# EAGLE design Curios (EAGLE 9.6.2)
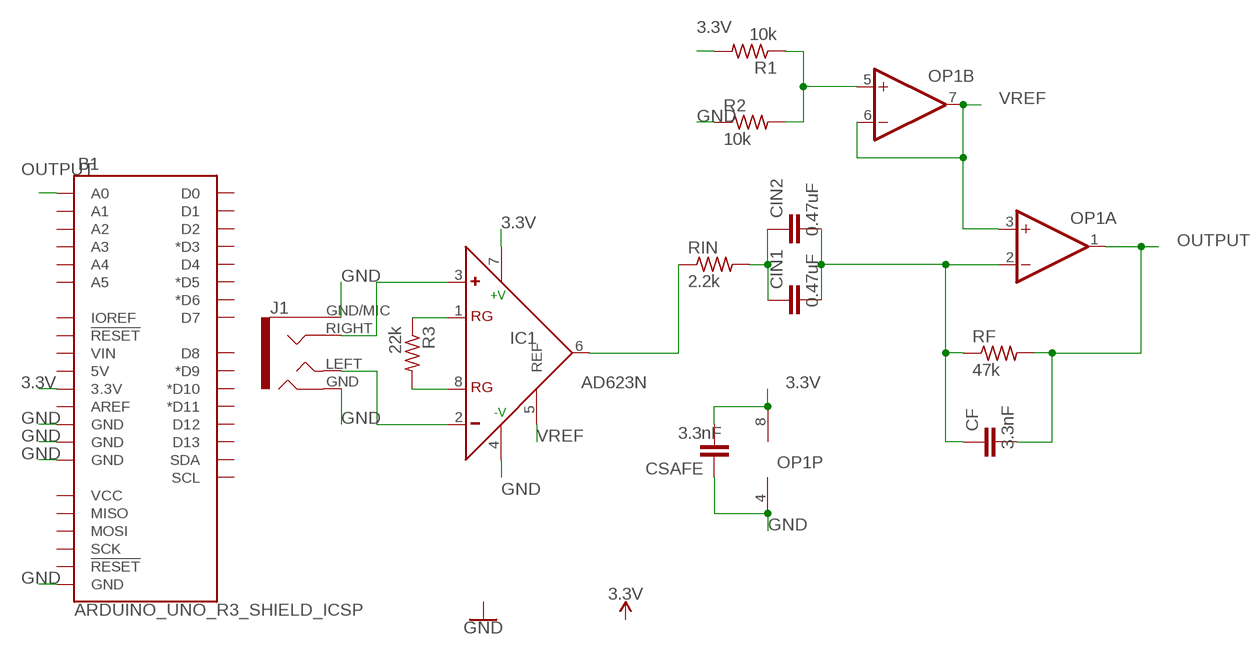
[diagram p0: schematic, sheet 1]

## Parts
B1  ARDUINO_UNO_R3_SHIELD_ICSP  [UNO_R3_SHIELD_ICSP]
CF  3.3nF  CAPACITOR0603  [C0603]
CIN1  0.47uF  CAPACITOR0603  [C0603]
CIN2  0.47uF  CAPACITOR0603  [C0603]
CSAFE  3.3nF  CAPACITOR0603  [C0603]
IC1  AD623N  [DIL08]
J1  AUDIO_JACK_TRRSSMD_RA  [AUDIO_JACK_3.5MM_TRRS_SMD_RA]
OP1  OP-DUALR  [SO8]
R1  10k  RESISTOR0603  [R0603]
R2  10k  RESISTOR0603  [R0603]
R3  22k  RESISTOR0603  [R0603]
RF  47k  RESISTOR0603  [R0603]
RIN  2.2k  RESISTOR0603  [R0603]

## Nets
3.3V: B1.3.3V CSAFE.2 IC1.7(+V) OP1.8(P:V+) R1.2
GND: B1.GND@0(GND) B1.GND@1(GND) B1.GND@2(GND) B1.GND_ICSP(GND) CSAFE.1 IC1.4(-V) J1.GND(RING2) J1.GND/MIC(SLEEVE) OP1.4(P:V-) R2.1
N$1: CIN1.1 CIN2.1 RIN.2
N$2: IC1.3(+) J1.RIGHT(RING1)
N$3: OP1.5(B:+IN) R1.1 R2.2
N$4: IC1.6(OUT) RIN.1
N$5: IC1.1(RG) R3.1
N$6: CF.1 CIN1.2 CIN2.2 OP1.2(A:-IN) RF.1
N$7: IC1.8(RG) R3.2
N$8: IC1.2(-) J1.LEFT(TIP)
OUTPUT: B1.A0 CF.2 OP1.1(A:OUT) RF.2
VREF: IC1.5(REF) OP1.3(A:+IN) OP1.6(B:-IN) OP1.7(B:OUT)
Unconnected: B1.5V B1.5V_ICSP(VCC) B1.A1 B1.A2 B1.A3 B1.A4 B1.A5 B1.AREF B1.D2 B1.D3(*D3) B1.D4 B1.D5(*D5) B1.D6(*D6) B1.D7 B1.D8 B1.D9(*D9) B1.D10(*D10) B1.D11(*D11) B1.D12 B1.D13 B1.IOREF B1.MISO B1.MOSI B1.RES(!RESET!) B1.RST_ICSP(!RESET!) B1.RX(D0) B1.SCK B1.SCL B1.SDA B1.TX(D1) B1.VIN

## Library data of the parts
B1 = LinnesLab-Microcontrollers:ARDUINO_UNO_R3_SHIELD_ICSP: Arduino R3 Shield Footprint with ICSP Header Includes pins for 6-pin (2x3) ICSP Header. Compatible with Leonardo boards that require SPI pin connections via this header. SparkFun Products: CryptoShield <https://www.sparkfun.com/products/13183> microSD Shield <https://www.sparkfun.com/products/12761> R3 Stackable Headers Kit <https://www.sparkfun.com/products/1417>
CF CIN1 CIN2 CSAFE = LinnesLab-Passives:CAPACITOR
IC1 = LinnesLab-AnalogIC:AD623: Single-Supply, Rail-to-Rail, Low Cost Instrumentation Amplifier Source: http://www.analog.com/static/imported-files/data_sheets/AD623.pdf; MF: ALTERA CORPORATION; MPN: AD623ANZ; OC_FARNELL: 9603700; OC_NEWARK: 59K4402
J1 = LinnesLab-Connectors:AUDIO_JACK_TRRS: Audio Jack - 3.5mm TRRS (SMD) This is a 3.5mm TRRS SMD audio jack. TRRS connectors are the audio-style connectors that you see on some phones, MP3 players and development boards. TRRS stands for “tip, ring, ring, sleeve,” which reflects that this has three conductors and a ground. SparkFun Products: Audio Jack <https://www.sparkfun.com/products/12639> mbed Starter Kit <https://www.sparkfun.com/products/12968> SparkFun TRRS 3.5mm Jack Breakout <https://www.sparkfun.com/products/11570>; PROD_ID: CONN-10676; SF_ID: PRT-12639
OP1 = LinnesLab-AnalogIC:OP-DUAL: Precision Micropower, Low Noise CMOS, Rail-to-Rail Input/Output Operational Amplifiers Source: http://www.analog.com/static/imported-files/data_sheets/AD8603_8607_8609.pdf; MPN: AD8607ARMZ-R2; OC_FARNELL: 1651293; OC_NEWARK: 19M8927
R1-R3 RF RIN = LinnesLab-Passives:RESISTOR

## Board
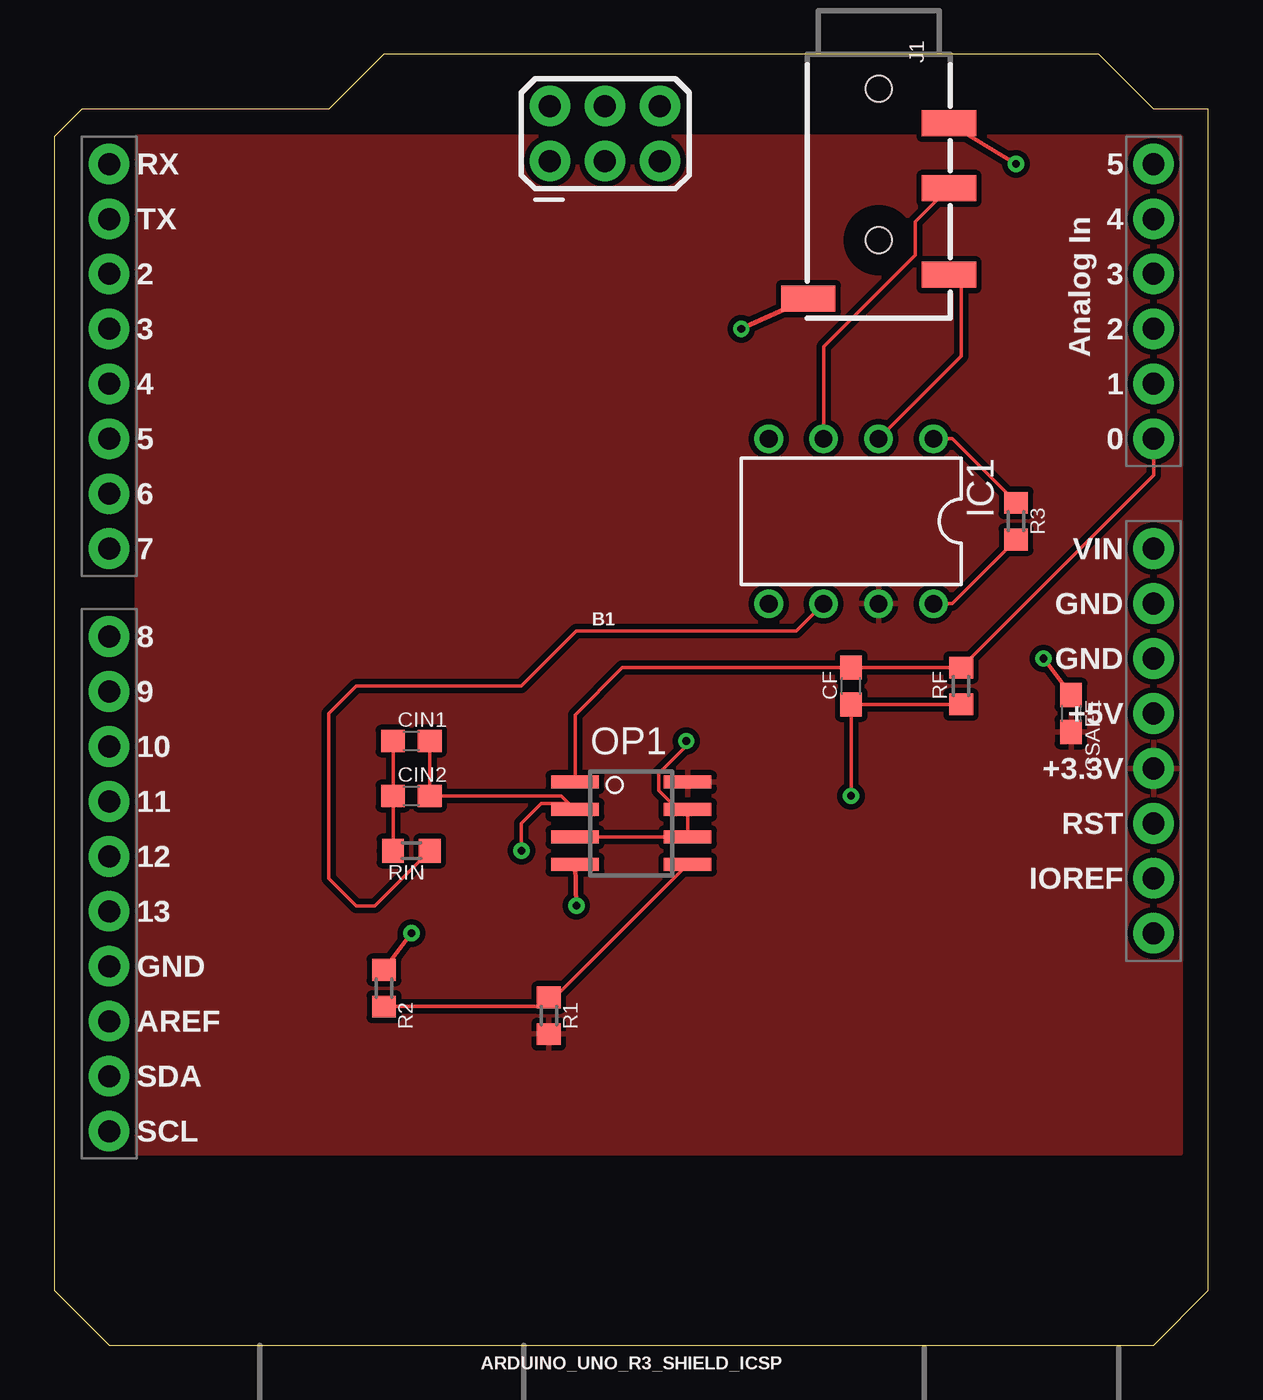
[diagram p1: board, top side]
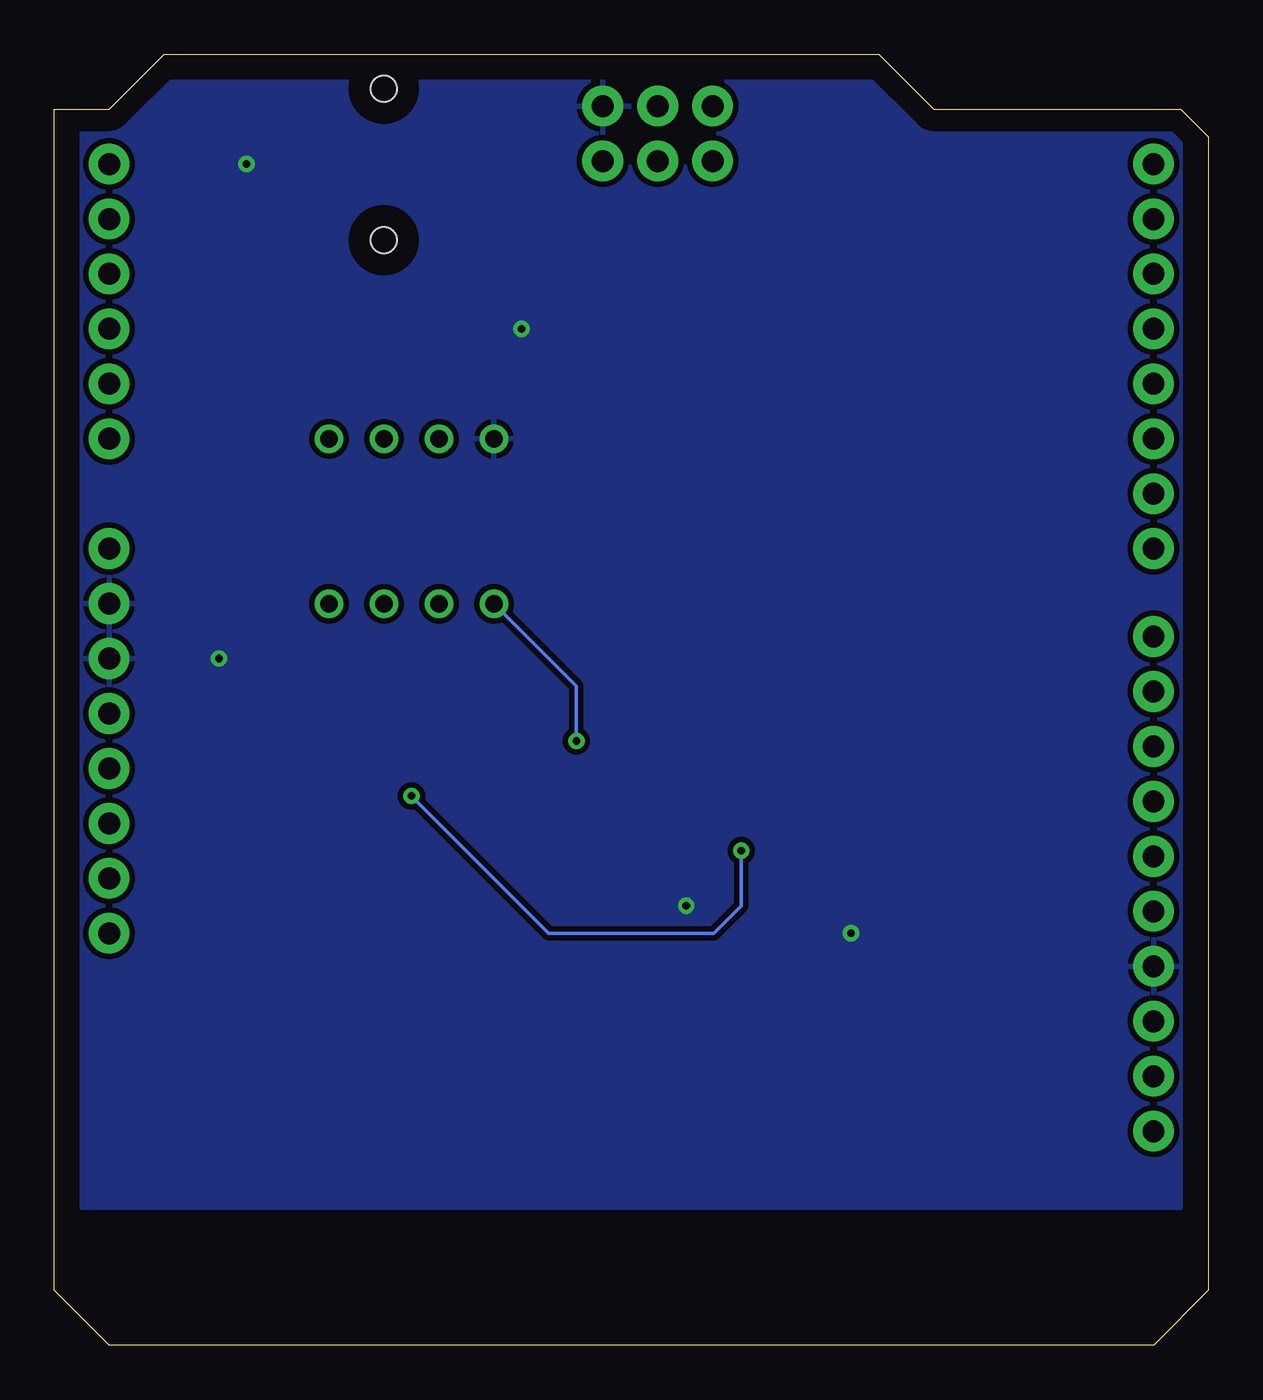
[diagram p2: board, bottom side, seen from below]

Size 53.34 x 59.69 mm. Coordinates in mm from the lower left corner, seen from the top.
Copper layers (1*16): Top 0.035mm / dielectric 1.5mm / Bottom 0.035mm
Design rules "default": minimum track width 6mil, minimum drill 0.35mm, track to track 6mil, track to pad 6mil, pad to pad 6mil, via to via 6mil, smd to smd 6mil, copper to edge 40mil, drill to drill 6mil, minimum pad ring 10mil, minimum via ring 8mil, stop-mask expansion 4mil, vias tented up to drill 0mil, thermal gap 10mil

### Footprints (pad centres in the part's own frame; a part is rotated, then mirrored left to right if it is on the bottom)
UNO_R3_SHIELD_ICSP = drill 1.016 pad 1.88: 3.3V 24.13,-3.81; 5V 24.13,-1.27; 5V_ICSP -3.76,26.81; A0 24.13,11.43; A1 24.13,13.97; A2 24.13,16.51; A3 24.13,19.05; A4 24.13,21.59; A5 24.13,24.13; AREF -24.13,-15.494; D2 -24.13,19.05; D3 -24.13,16.51; D4 -24.13,13.97; D5 -24.13,11.43; D6 -24.13,8.89; D7 -24.13,6.35; D8 -24.13,2.286; D9 -24.13,-0.254; D10 -24.13,-2.794; D11 -24.13,-5.334; D12 -24.13,-7.874; D13 -24.13,-10.414; GND@0 24.13,1.27; GND@1 24.13,3.81; GND@2 -24.13,-12.954; GND_ICSP 1.32,26.81; IOREF 24.13,-8.89; MISO -3.76,24.27; MOSI -1.22,26.81; NC 24.13,-11.43; RES 24.13,-6.35; RST_ICSP 1.32,24.27; RX -24.13,24.13; SCK -1.22,24.27; SCL -24.13,-20.574; SDA -24.13,-18.034; TX -24.13,21.59; VIN 24.13,6.35
C0603 = smd 1.1 x 1: 1 -0.85,0; 2 0.85,0
DIL08 = drill 0.813 pad 1.27: 1 -3.81,-3.81; 2 -1.27,-3.81; 3 1.27,-3.81; 4 3.81,-3.81; 5 3.81,3.81; 6 1.27,3.81; 7 -1.27,3.81; 8 -3.81,3.81
AUDIO_JACK_3.5MM_TRRS_SMD_RA = smd 1.2 x 2.5: GND 3.2,3.25; GND/MIC 11.3,-3.25; LEFT 10.2,3.25; RIGHT 6.2,3.25 | hole 1.2: 1.6,0; 8.6,0
SO8 = smd 0.6 x 2.2: 1 -1.905,-2.6; 2 -0.635,-2.6; 3 0.635,-2.6; 4 1.905,-2.6; 5 1.905,2.6; 6 0.635,2.6; 7 -0.635,2.6; 8 -1.905,2.6
R0603 = smd 1 x 1.1: 1 -0.85,0; 2 0.85,0

### Placement (x,y rotation side)
B1  26.67,30.48 0 top
CF  36.83,30.48 90 top
CIN1  16.51,27.94 0 top
CIN2  16.51,25.4 0 top
CSAFE  46.99,29.21 270 top
IC1  36.83,38.1 180 top
J1  38.1,59.69 270 top
OP1  26.67,24.13 270 top
R1  22.86,15.24 270 top
R2  15.24,16.51 270 top
R3  44.45,38.1 270 top
RF  41.91,30.48 90 top
RIN  16.51,22.86 180 top

### Tracks (layer width: path | path; a pad name or v marks a point on that pad's centre or on a via)
3.3V
  pour Top (isolate 0.254): 3.81,55.88 3.81,8.89 52.07,8.89 52.07,55.88
GND  (via drill 0.35)
  Top 0.152: 15.07,17.53 R2.1
  Top 0.203: OP1.4 v24.13,20.32 | R2.1 v16.51,19.05 | CSAFE.1 v45.72,31.75 | J1.GND v44.45,54.61 | J1.GND/MIC v31.75,46.99
  pour Bottom (isolate 0.254): 1.27,58.42 1.27,6.35 52.07,6.35 52.07,58.42
N$1
  Top 0.152: CIN1.1 CIN2.1 15.66,23.28 15.24,22.86 RIN.2
N$2
  Top 0.152: J1.RIGHT 39.79,51.93 39.79,50.39 35.56,46.16 IC1.3
N$3
  Top 0.152: R2.2 22.43,15.66 R1.1 23.14,16.09 OP1.5
N$4
  Top 0.152: RIN.1 14.82,20.32 13.97,20.32 12.7,21.59 12.7,29.21 13.97,30.48 21.59,30.48 24.13,33.02 34.29,33.02 IC1.6
N$5
  Top 0.152: IC1.1 41.49,41.91 R3.1
N$6  (via drill 0.35)
  Top 0.152: RF.1 CF.1 v36.83,25.4 | CIN1.2 CIN2.2 23.43,25.4 23.78,25.05 | 23.78,25.05 OP1.2 | v21.59,22.86 21.59,24.13 22.51,25.05 23.78,25.05
  Bottom 0.152: v21.59,22.86 21.59,20.32 22.86,19.05 30.48,19.05 v36.83,25.4
N$7
  Top 0.152: IC1.8 41.49,34.29 R3.2
N$8
  Top 0.152: J1.LEFT 41.91,48.93 41.91,45.72 IC1.2
OUTPUT
  Top 0.152: B1.A0 50.8,40.22 RF.2 CF.2 26.25,31.33 24.07,29.15 OP1.1
VREF  (via drill 0.35)
  Top 0.152: OP1.3 OP1.6 OP1.7 28.82,24.76 27.94,25.64 27.94,26.43 29.21,27.7 v29.21,27.94
  Bottom 0.152: IC1.5 29.21,30.48 v29.21,27.94